# Altium schematic sheet RF_SCH1.SchDoc
size A
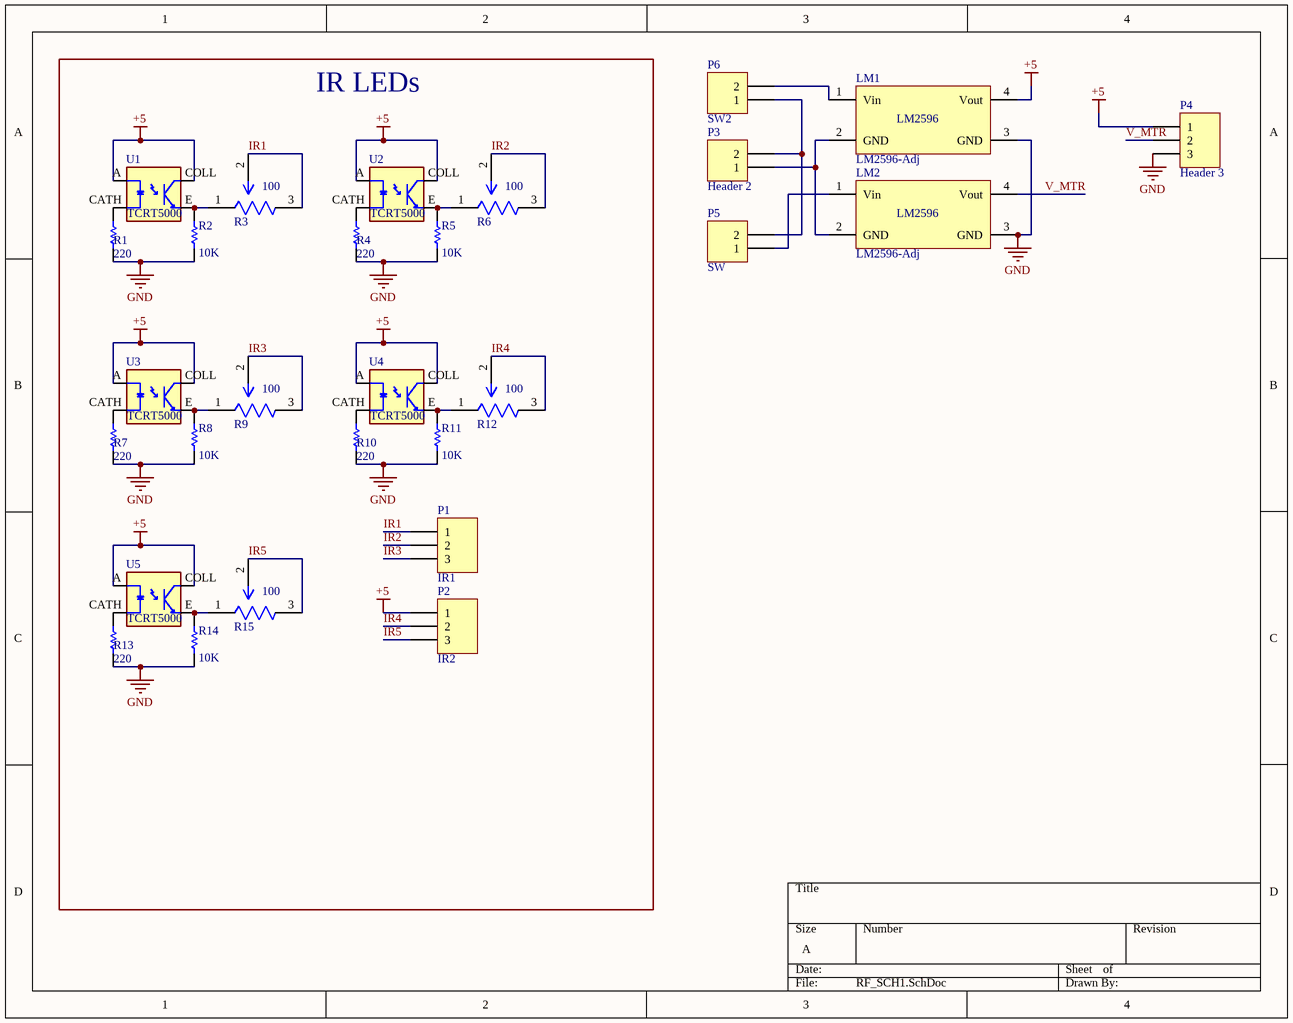
[diagram p0: RF_SCH1.SchDoc]

## Parts
LM1  LM2596-Adj  [lm2596]
LM2  LM2596-Adj  [lm2596]
P1  IR1  [HDR1X3]
P2  IR2  [HDR1X3]
P3  Header 2  [HDR1X2]
P4  Header 3  [HDR1X3]
P5  SW  [HDR1X2]
P6  SW2  [HDR1X2]
R1  value 220  [AXIAL-0.3]  (hidden comment: Res1)
R2  value 10K  [AXIAL-0.3]  (hidden comment: Res1)
R3  100  [FP-3386F-MFG]
R4  value 220  [AXIAL-0.3]  (hidden comment: Res1)
R5  value 10K  [AXIAL-0.3]  (hidden comment: Res1)
R6  100  [FP-3386F-MFG]
R7  value 220  [AXIAL-0.3]  (hidden comment: Res1)
R8  value 10K  [AXIAL-0.3]  (hidden comment: Res1)
R9  100  [FP-3386F-MFG]
R10  value 220  [AXIAL-0.3]  (hidden comment: Res1)
R11  value 10K  [AXIAL-0.3]  (hidden comment: Res1)
R12  100  [FP-3386F-MFG]
R13  value 220  [AXIAL-0.3]  (hidden comment: Res1)
R14  value 10K  [AXIAL-0.3]  (hidden comment: Res1)
R15  100  [FP-3386F-MFG]
U1  TCRT5000  [OPTO_TCRT5000]
U2  TCRT5000  [OPTO_TCRT5000]
U3  TCRT5000  [OPTO_TCRT5000]
U4  TCRT5000  [OPTO_TCRT5000]
U5  TCRT5000  [OPTO_TCRT5000]

## Blocks framed on the sheet
IR LEDs: P1 P2 R1-R15 U1-U5

## Nets
+5: LM1.4(Vout) P2.1 P4.1 U1.A U1.COLL U2.A U2.COLL U3.A U3.COLL U4.A U4.COLL U5.A U5.COLL
GND: LM1.3(GND) LM2.3(GND) P4.3 R1.1 R2.1 R4.1 R5.1 R7.1 R8.1 R10.1 R11.1 R13.1 R14.1
IR1: P1.1 R3.2(WIPER) R3.3(CW)
IR2: P1.2 R6.2(WIPER) R6.3(CW)
IR3: P1.3 R9.2(WIPER) R9.3(CW)
IR4: P2.2 R12.2(WIPER) R12.3(CW)
IR5: P2.3 R15.2(WIPER) R15.3(CW)
V_MTR: LM2.4(Vout) P4.2
NetLM1_1: LM1.1(Vin) P6.2
NetLM1_2: LM1.2(GND) LM2.2(GND) P3.1
NetLM2_1: LM2.1(Vin) P5.1
NetP3_2: P3.2 P5.2 P6.1
NetR1_2: R1.2 U1.CATH
NetR2_2: R2.2 R3.1(CCW) U1.E
NetR4_2: R4.2 U2.CATH
NetR5_2: R5.2 R6.1(CCW) U2.E
NetR7_2: R7.2 U3.CATH
NetR8_2: R8.2 R9.1(CCW) U3.E
NetR10_2: R10.2 U4.CATH
NetR11_2: R11.2 R12.1(CCW) U4.E
NetR13_2: R13.2 U5.CATH
NetR14_2: R14.2 R15.1(CCW) U5.E

## Notes on the sheet
- (in symbol LM2596-Adj) LM2596

## Library data of the parts
LM1 LM2 = LM2596-Adj: Designed By @Alixahedi
P1 P2 P4 = Header 3: Header, 3-Pin; LatestRevisionDate: 17-Jul-2002; LatestRevisionNote: Re-released for DXP Platform.; Publisher: Altium Limited
P3 P5 P6 = Header 2: Header, 2-Pin; LatestRevisionDate: 17-Jul-2002; LatestRevisionNote: Re-released for DXP Platform.; Publisher: Altium Limited
R1 R2 R4 R5 R7 R8 R10 R11 R13 R14 = Res1: Resistor; Published: 8-Jun-2000; LatestRevisionDate: 17-Jul-2002; LatestRevisionNote: Re-released for DXP Platform.; PackageReference: AXIAL-0.3; Publisher: Altium Limited; PackageDescription: Axial Device, Thru-Hole; 2 Leads; 0.3 in Pin Spacing
R3 R6 R9 R12 R15 = CMP-07234-000018-1: TRIMMER 30K OHM 0.5W PC PIN TOP; Manufacturer Part Number: 3386F-1-303LF; Manufacturer: Bourns; Voltage Rating: 300V; Tolerance: 10%; Value: 30kΩ; Standoff Height: 0.38mm; Temperature Coefficient: 100ppm/°C; Category: Res; Series: 3386; Device Class L1: Passive Components; Temperature Range Low: -55°C; RoHS: TRUE; Temperature: -55°C to +125°C; Device Class L2: Resistors; ComponentLink2URL: https://www.bourns.com/docs/Product-Datasheets/3386.pdf; Mouser Description: Trimmer Resistors - Through Hole 3/8 30Kohms 10% 0.5Watts Square; Octopart: https://octopart.com/3386f-1-303lf-bourns-1032328; Digikey Description: TRIMMER 30K OHM 0.5W PC PIN TOP; Lead Free: Yes; Automotive: No; Package: 3386F; Temperature Range High: +125°C; Composition: Cermet; ComponentLink2Description: Datasheet; Power Rating: 0.5W; Height: 5.08mm; Resistance: 30kΩ; Device Class L3: Variable Resistors and Potentiometers
U1-U5 = TCRT5000: 950 nm 60 mA Through Hole Reflective Optical Sensor with Transistor Output; Availability: Unavailable; MP: TCRT5000; Value: *; Price: None; Package: None